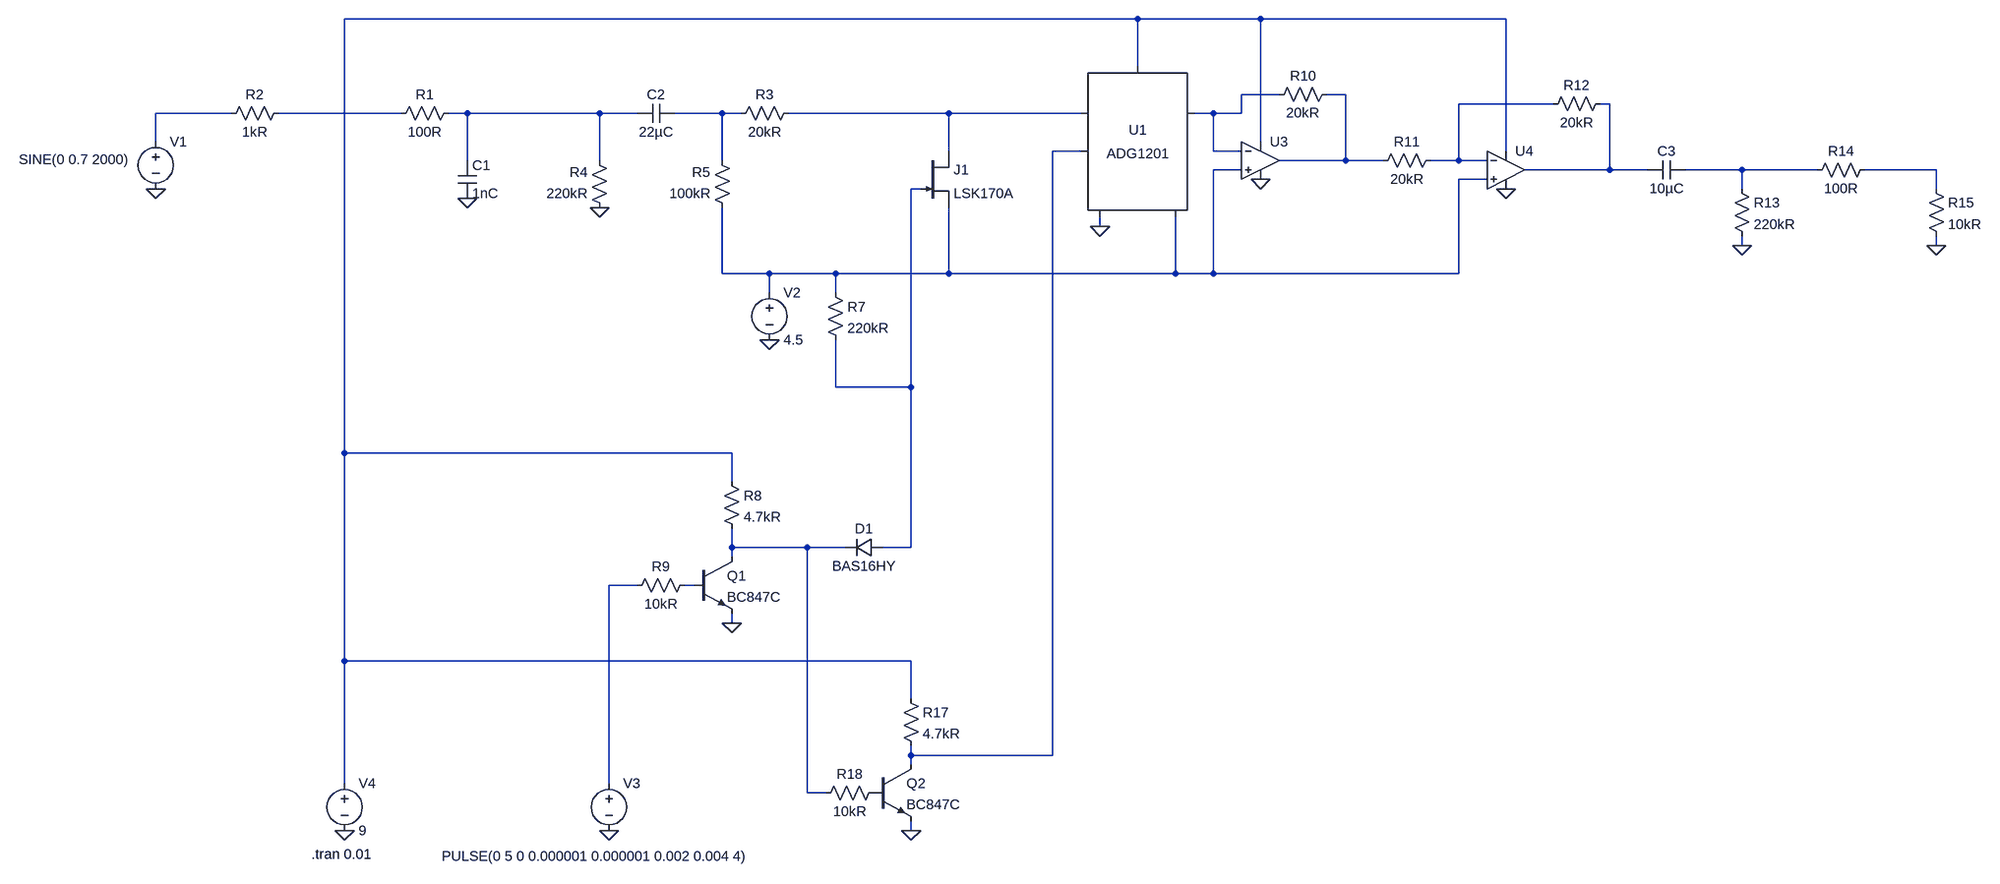
[diagram p0: schematic Audio_path.asc]
Audio_path.asc, the LTspice schematic file:
Version 4
SHEET 1 2084 1896
WIRE 640 -64 -704 -64
WIRE 848 -64 640 -64
WIRE 1264 -64 848 -64
WIRE 640 16 640 -64
WIRE 880 64 816 64
WIRE 992 64 960 64
WIRE 1344 80 1184 80
WIRE 1440 80 1424 80
WIRE -896 96 -1024 96
WIRE -608 96 -816 96
WIRE -496 96 -528 96
WIRE -272 96 -496 96
WIRE -208 96 -272 96
WIRE -64 96 -144 96
WIRE -32 96 -64 96
WIRE 320 96 48 96
WIRE 544 96 320 96
WIRE 768 96 736 96
WIRE 816 96 816 64
WIRE 816 96 768 96
WIRE -1024 144 -1024 96
WIRE 848 144 848 -64
WIRE 320 160 320 96
WIRE 544 160 496 160
WIRE 768 160 768 96
WIRE 816 160 768 160
WIRE 1264 160 1264 -64
WIRE -496 176 -496 96
WIRE -272 176 -272 96
WIRE -64 176 -64 96
WIRE 992 176 992 64
WIRE 992 176 880 176
WIRE 1056 176 992 176
WIRE 1184 176 1184 80
WIRE 1184 176 1136 176
WIRE 1232 176 1184 176
WIRE 816 192 768 192
WIRE 1440 192 1440 80
WIRE 1440 192 1296 192
WIRE 1504 192 1440 192
WIRE 1664 192 1568 192
WIRE 1792 192 1664 192
WIRE 2000 192 1872 192
WIRE 1232 208 1184 208
WIRE 272 224 256 224
WIRE 1664 224 1664 192
WIRE 2000 224 2000 192
WIRE 576 288 576 272
WIRE 1664 320 1664 304
WIRE 2000 320 2000 304
WIRE -64 368 -64 256
WIRE 16 368 -64 368
WIRE 128 368 16 368
WIRE 320 368 320 256
WIRE 320 368 128 368
WIRE 704 368 704 272
WIRE 704 368 320 368
WIRE 768 368 768 192
WIRE 768 368 704 368
WIRE 1184 368 1184 208
WIRE 1184 368 768 368
WIRE 16 400 16 368
WIRE 128 400 128 368
WIRE 128 560 128 480
WIRE 256 560 256 224
WIRE 256 560 128 560
WIRE -704 672 -704 -64
WIRE -48 672 -704 672
WIRE -48 720 -48 672
WIRE -48 832 -48 800
WIRE 80 832 -48 832
WIRE 144 832 80 832
WIRE 256 832 256 560
WIRE 256 832 208 832
WIRE -48 848 -48 832
WIRE -208 896 -256 896
WIRE -112 896 -128 896
WIRE -48 960 -48 944
WIRE -704 1024 -704 672
WIRE 256 1024 -704 1024
WIRE 256 1088 256 1024
WIRE 256 1184 256 1168
WIRE 496 1184 496 160
WIRE 496 1184 256 1184
WIRE 256 1200 256 1184
WIRE -704 1232 -704 1024
WIRE -256 1232 -256 896
WIRE 80 1248 80 832
WIRE 112 1248 80 1248
WIRE 256 1312 256 1296
FLAG 16 480 0
FLAG -1024 224 0
FLAG -496 240 0
FLAG -272 256 0
FLAG -256 1312 0
FLAG -704 1312 0
FLAG -48 960 0
FLAG 848 208 0
FLAG 1264 224 0
FLAG 2000 320 0
FLAG 1664 320 0
FLAG 576 288 0
FLAG 256 1312 0
SYMBOL njf 272 160 R0
SYMATTR InstName J1
SYMATTR Value LSK170A
SYMBOL res -512 80 R90
WINDOW 0 0 56 VBottom 2
WINDOW 3 32 56 VTop 2
SYMATTR InstName R1
SYMATTR Value 100R
SYMBOL res 64 80 R90
WINDOW 0 0 56 VBottom 2
WINDOW 3 32 56 VTop 2
SYMATTR InstName R3
SYMATTR Value 20kR
SYMBOL res -256 272 R180
WINDOW 0 36 76 Left 2
WINDOW 3 36 40 Left 2
SYMATTR InstName R4
SYMATTR Value 220kR
SYMBOL res -48 272 R180
WINDOW 0 36 76 Left 2
WINDOW 3 36 40 Left 2
SYMATTR InstName R5
SYMATTR Value 100kR
SYMBOL cap -512 176 R0
SYMATTR InstName C1
SYMATTR Value 1nC
SYMBOL cap -144 80 R90
WINDOW 0 0 32 VBottom 2
WINDOW 3 32 32 VTop 2
SYMATTR InstName C2
SYMATTR Value 22µC
SYMBOL voltage -1024 128 R0
WINDOW 3 -232 46 Left 2
WINDOW 123 0 0 Left 0
WINDOW 39 0 0 Left 0
SYMATTR Value SINE(0 0.7 2000)
SYMATTR InstName V1
SYMBOL voltage 16 384 R0
WINDOW 123 0 0 Left 0
WINDOW 39 0 0 Left 0
SYMATTR InstName V2
SYMATTR Value 4.5
SYMBOL res 112 384 R0
SYMATTR InstName R7
SYMATTR Value 220kR
SYMBOL diode 208 816 R90
WINDOW 0 0 32 VBottom 2
WINDOW 3 32 32 VTop 2
SYMATTR InstName D1
SYMATTR Value BAS16HY
SYMBOL res -64 704 R0
SYMATTR InstName R8
SYMATTR Value 4.7kR
SYMBOL res -112 880 R90
WINDOW 0 0 56 VBottom 2
WINDOW 3 32 56 VTop 2
SYMATTR InstName R9
SYMATTR Value 10kR
SYMBOL voltage -256 1216 R0
WINDOW 123 0 0 Left 0
WINDOW 39 0 0 Left 0
WINDOW 3 -283 139 Left 2
SYMATTR Value PULSE(0 5 0 0.000001 0.000001 0.002 0.004 4)
SYMATTR InstName V3
SYMBOL voltage -704 1216 R0
WINDOW 123 0 0 Left 0
WINDOW 39 0 0 Left 0
SYMATTR InstName V4
SYMATTR Value 9
SYMBOL npn -112 848 R0
SYMATTR InstName Q1
SYMATTR Value BC847C
SYMBOL res -800 80 R90
WINDOW 0 0 56 VBottom 2
WINDOW 3 32 56 VTop 2
SYMATTR InstName R2
SYMATTR Value 1kR
SYMBOL res 976 48 R90
WINDOW 0 0 56 VBottom 2
WINDOW 3 32 56 VTop 2
SYMATTR InstName R10
SYMATTR Value 20kR
SYMBOL res 1152 160 R90
WINDOW 0 0 56 VBottom 2
WINDOW 3 32 56 VTop 2
SYMATTR InstName R11
SYMATTR Value 20kR
SYMBOL res 1440 64 R90
WINDOW 0 0 56 VBottom 2
WINDOW 3 32 56 VTop 2
SYMATTR InstName R12
SYMATTR Value 20kR
SYMBOL cap 1568 176 R90
WINDOW 0 0 32 VBottom 2
WINDOW 3 32 32 VTop 2
SYMATTR InstName C3
SYMATTR Value 10µC
SYMBOL res 1648 208 R0
SYMATTR InstName R13
SYMATTR Value 220kR
SYMBOL res 1888 176 R90
WINDOW 0 0 56 VBottom 2
WINDOW 3 32 56 VTop 2
SYMATTR InstName R14
SYMATTR Value 100R
SYMBOL res 1984 208 R0
SYMATTR InstName R15
SYMATTR Value 10kR
SYMBOL OpAmps\\UniversalOpAmp 848 176 R0
SYMATTR InstName U3
SYMBOL OpAmps\\UniversalOpAmp 1264 192 R0
SYMATTR InstName U4
SYMBOL Switches\\ADG1201 640 144 R0
SYMATTR InstName U1
SYMBOL res 240 1072 R0
SYMATTR InstName R17
SYMATTR Value 4.7kR
SYMBOL res 208 1232 R90
WINDOW 0 0 56 VBottom 2
WINDOW 3 32 56 VTop 2
SYMATTR InstName R18
SYMATTR Value 10kR
SYMBOL npn 192 1200 R0
SYMATTR InstName Q2
SYMATTR Value BC847C
TEXT -760 1352 Left 2 !.tran 0.01

The netlist it stands for:
* Audio_path.asc
J1 N010 N015 N012 LSK170A
R1 N008 N007 100R
R3 N010 N009 20kR
R4 0 N008 220kR
R5 N012 N009 100kR
C1 N008 0 1nC
C2 N009 N008 22µC
V1 N006 0 SINE(0 0.7 2000)
V2 N012 0 4.5
R7 N012 N015 220kR
D1 N015 N016 BAS16HY
R8 N001 N016 4.7kR
R9 N018 N017 10kR
V3 N017 0 PULSE(0 5 0 0.000001 0.000001 0.002 0.004 4)
V4 N001 0 9
Q1 N016 N018 0 0 BC847C
R2 N007 N006 1kR
R10 N003 N002 20kR
R11 N004 N003 20kR
R12 N005 N004 20kR
C3 N013 N005 10µC
R13 N013 0 220kR
R14 N014 N013 100R
R15 N014 0 10kR
XU3 N012 N002 N001 0 N003 level1 Avol=1Meg GBW=10Meg Vos=0 En=0 Enk=0 In=0 Ink=0 Rin=500Meg  ; pins In+ In- V+ V- OUT
XU4 N012 N004 N001 0 N005 level1 Avol=1Meg GBW=10Meg Vos=0 En=0 Enk=0 In=0 Ink=0 Rin=500Meg  ; pins In+ In- V+ V- OUT
XU1 N011 N002 N010 0 N012 N001 ADG1201
R17 N001 N011 4.7kR
R18 P001 N016 10kR
Q2 N011 P001 0 0 BC847C
.model D D
.lib standard.dio
.model NPN NPN
.model PNP PNP
.lib standard.bjt
.model NJF NJF
.model PJF PJF
.lib standard.jft
.tran 0.01
.lib UniversalOpAmp1.lib
.lib ADG1201.sub
.backanno
.end